# EAGLE schematic pid (EAGLE 6.6.0)
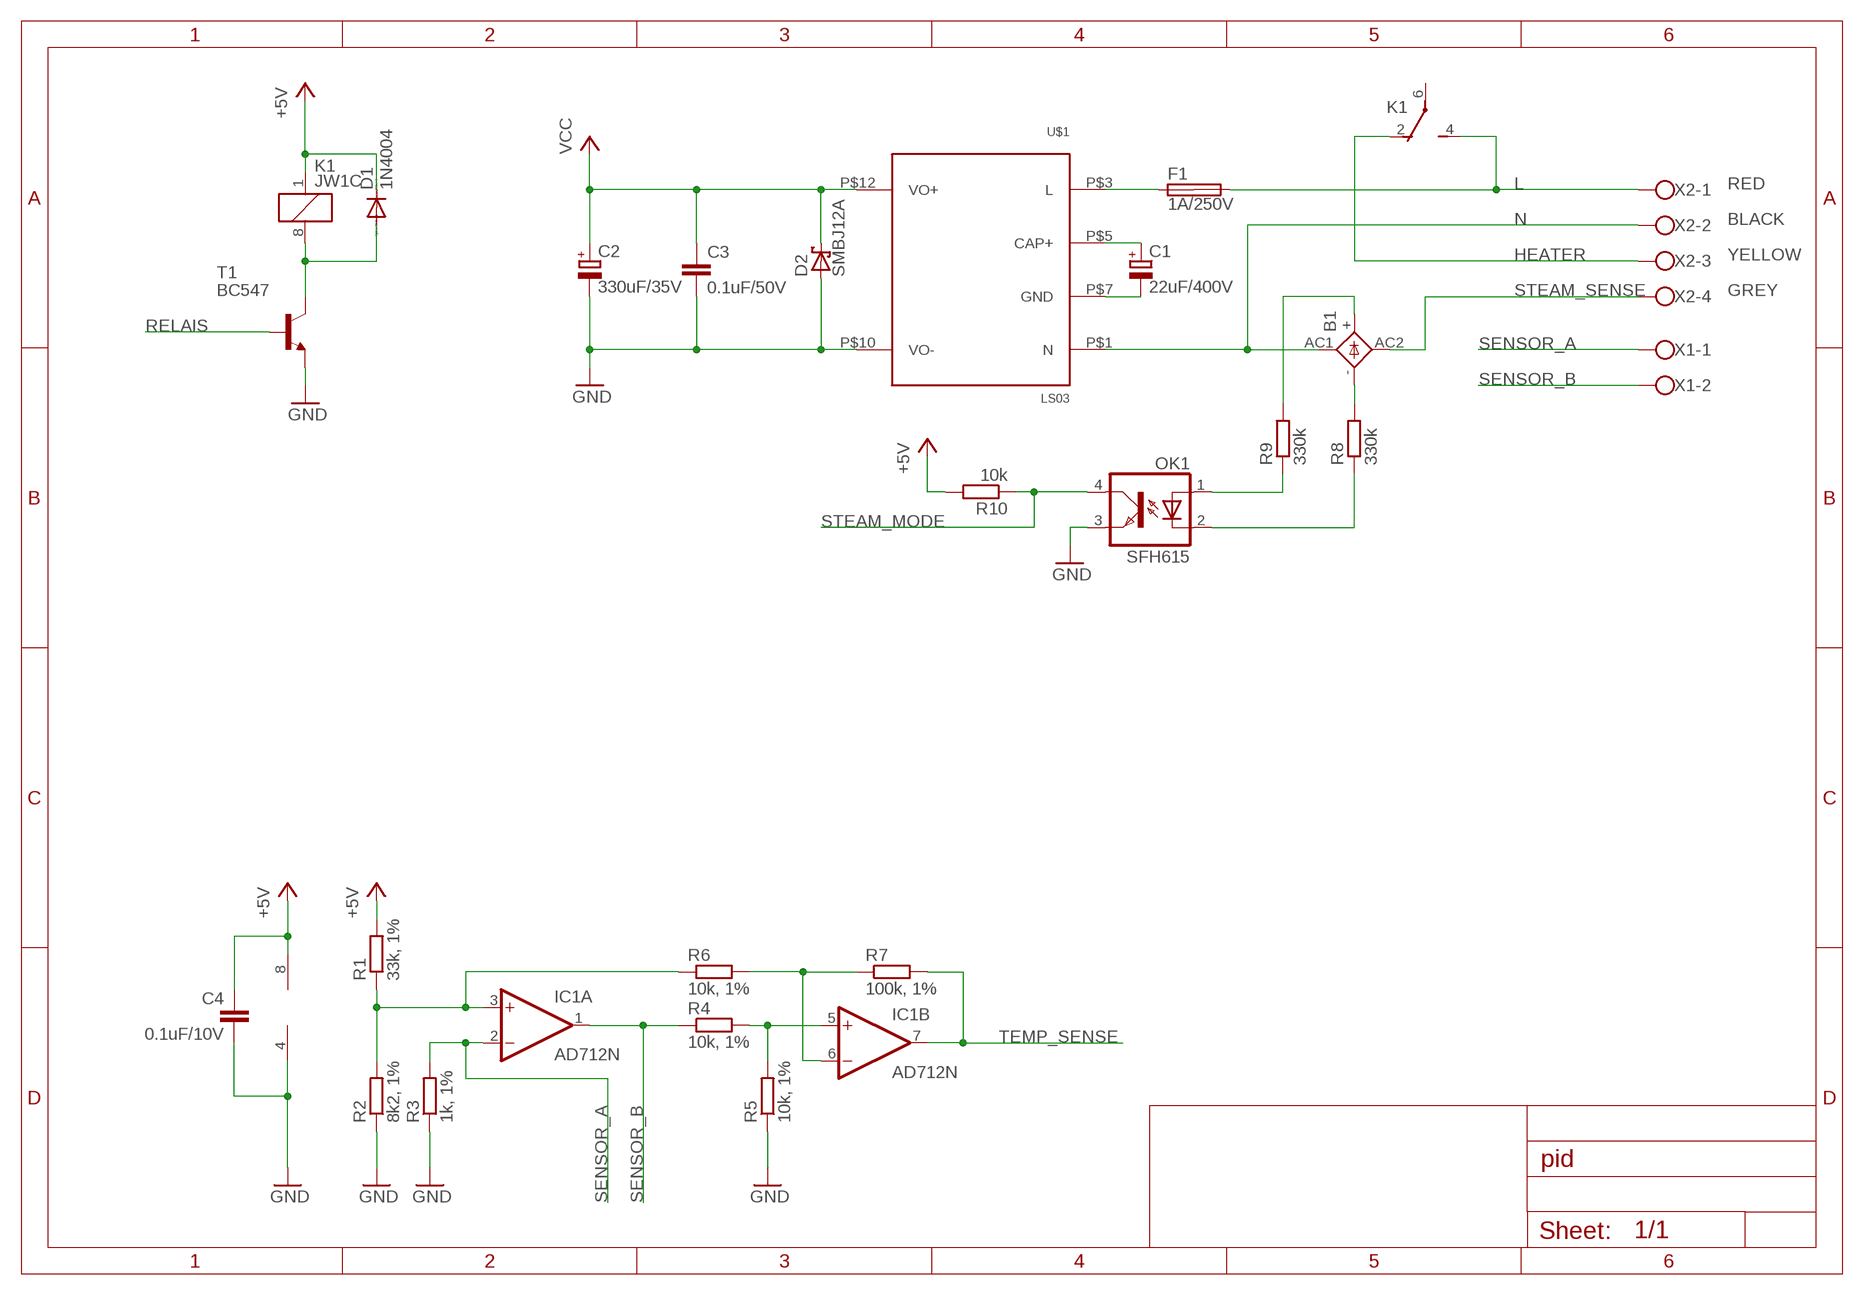
[diagram p0: schematic, sheet 1]

## Parts
B1  1KAB  [1KAB]
C1  22uF/400V  CPOL-EUE3.5-10  [E3,5-10]
C2  330uF/35V  CPOL-EUE7.5-16  [E7,5-16]
C3  0.1uF/50V  C-EU025-050X050  [C025-050X050]
C4  0.1uF/10V  C-EU025-050X050  [C025-050X050]
D1  1N4004  [DO41-10]
D2  SMBJ12A  P6KEXX  [CB417-15]
F1  1A/250V  SHK20Q  [SHK20Q]
IC1  AD712N  [DIL08]
K1  JW1C  [JW1C]
OK1  SFH615  [DIL04]
R1  33k, 1%  R-EU_0207/10  [0207/10]
R2  8k2, 1%  R-EU_0207/10  [0207/10]
R3  1k, 1%  R-EU_0207/10  [0207/10]
R4  10k, 1%  R-EU_0207/10  [0207/10]
R5  10k, 1%  R-EU_0207/10  [0207/10]
R6  10k, 1%  R-EU_0207/10  [0207/10]
R7  100k, 1%  R-EU_0207/10  [0207/10]
R8  330k  R-EU_0207/10  [0207/10]
R9  330k  R-EU_0207/10  [0207/10]
R10  10k  R-EU_0207/10  [0207/10]
T1  BC547  [TO92]
U$1  LS03  [LS03]
X1  W239-302  [W239-302]
X2  W239-104  [W239-104]

## Nets
+5V: C4.1 D1.C IC1.8(P:V+) K1.1 R1.2 R10.2
GND: C2.- C3.2 C4.2 D2.A IC1.4(P:V-) OK1.3(EMIT) R2.1 R3.1 R5.1 T1.1(E) U$1.P$10(VO-)
HEATER: K1.2(1:O) X2.3
L: F1.2A K1.4(1:S) X2.1
N: B1.AC1 U$1.P$1(N) X2.2
N$1: F1.1A U$1.P$3(L)
N$2: D1.A K1.8 T1.3(C)
N$3: IC1.3(A:+IN) R1.1 R2.2 R6.1
N$4: OK1.2(C) R8.1
N$5: C1.- U$1.P$7(GND)
N$6: C1.+ U$1.P$5(CAP+)
N$7: IC1.5(B:+IN) R4.2 R5.2
N$8: IC1.6(B:-IN) R6.2 R7.1
N$9: OK1.1(A) R9.1
N$10: B1.- R8.2
N$11: B1.+ R9.2
RELAIS: T1.2(B)
SENSOR_A: IC1.2(A:-IN) R3.2 X1.1
SENSOR_B: IC1.1(A:OUT) R4.1 X1.2
STEAM_MODE: OK1.4(COL) R10.1
STEAM_SENSE: B1.AC2 X2.4
TEMP_SENSE: IC1.7(B:OUT) R7.2
VCC: C2.+ C3.1 D2.C U$1.P$12(VO+)
Unconnected: F1.1B F1.2B K1.6(1:P)

## Notes on the sheet
- RED
- BLACK
- YELLOW
- GREY

## Library data of the parts
B1 = rectifier:1KAB: RECTIFIER grid 5,08 x 5,08 mm
C1 C2 = rcl:CPOL-EU: POLARIZED CAPACITOR, European symbol
C3 C4 = rcl:C-EU: CAPACITOR, European symbol
D1 = diode:1N4004: DIODE general purpose rectifier, 1 A
D2 = diode:P6KEXX: DIODE transient-voltage suppressor
F1 = fuse:SHK20Q: FUSE HOLDER 5 x 20 mm, SH contact, E1207 Buerklin 64G6061; OC_FARNELL: unknown; OC_NEWARK: unknown
IC1 = linear:AD712: OP AMP
K1 = relay:JW1C: Power relay Source: Panasonic Electric Works Co., Ltd. / jw.catalog.pdf
OK1 = optocoupler:SFH615: SIEMENS OPTO COUPLER; MPN: SFH615A-2; OC_FARNELL: 1045382; OC_NEWARK: 97K9544
R1-R10 = rcl:R-EU_: RESISTOR, European symbol
T1 = transistor:BC547: NPN TRANSISTOR
U$1 = ls03:LS03: LS 03-R2 SERIES High efficiency green power modules with miniature packaging provided by Mornsun. The features of this series are: wide input voltage, dc and ac all in one, high efficiency, high reliability, low loss, safety isolation etc, meet UL60950/EN60950 standards. All models are suitable for the applications demanding on the volume, need to meet UL/ CE standard, less demanding on EMC like industrial, electric power, instrumentation, smart home. For harsh EMC environment, this series of products must use the refered application circuit.
X1 = con-wago-500:W239-302: WAGO SCREW CLAMP; OC_FARNELL: unknown; OC_NEWARK: unknown
X2 = con-wago-500:W239-104: WAGO SCREW CLAMP; OC_FARNELL: unknown; OC_NEWARK: unknown